# EAGLE design extruderControllerv02 (EAGLE 9.2.2)
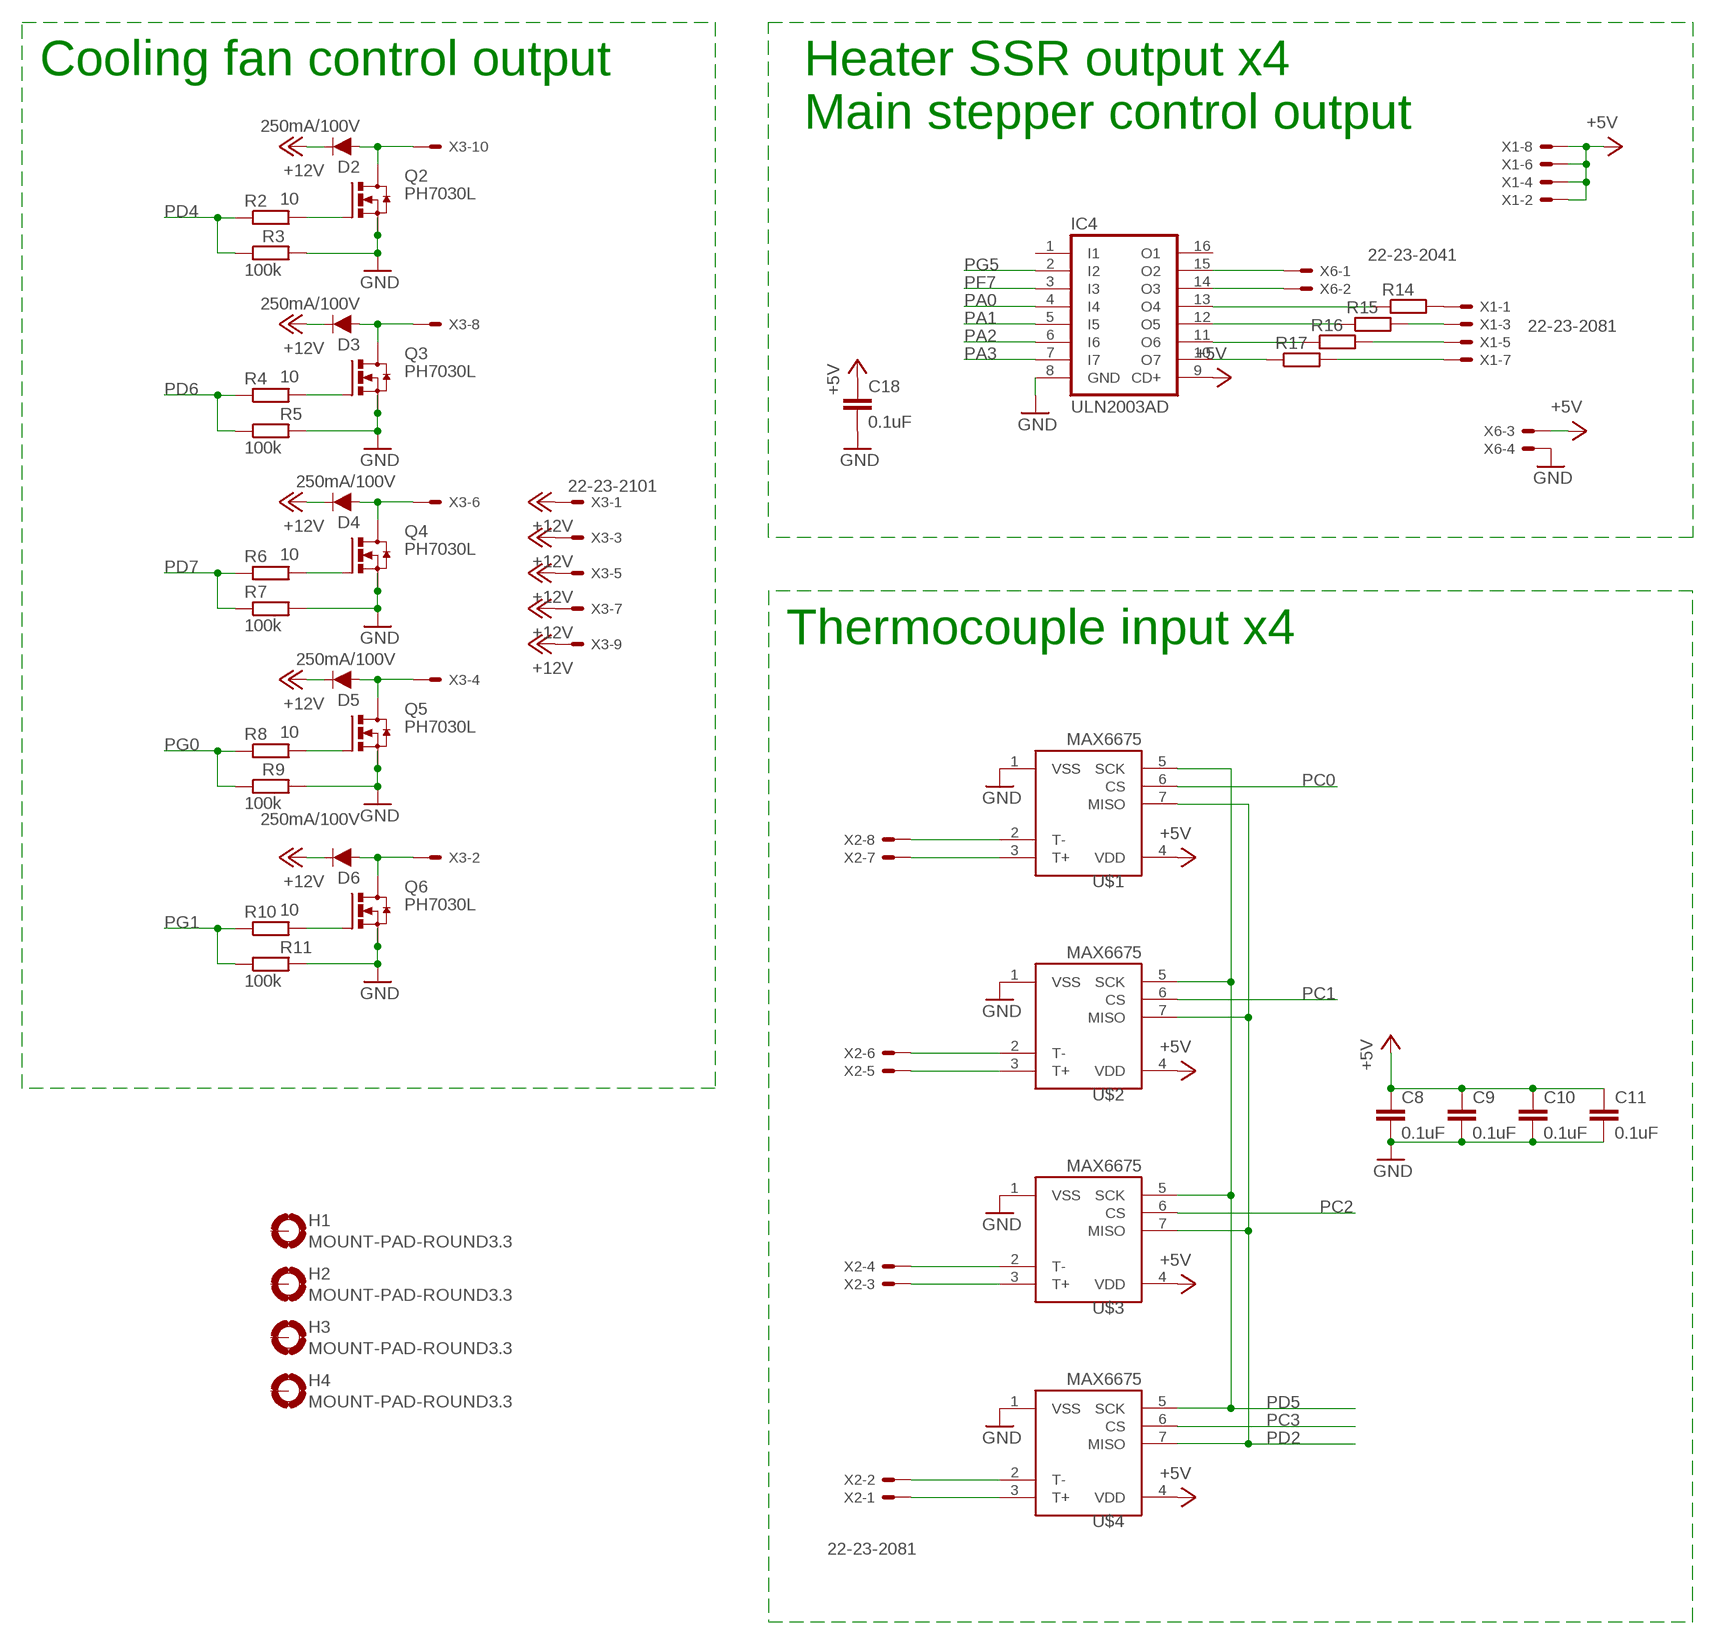
[diagram p0: schematic, sheet 1, part 1 of 2]
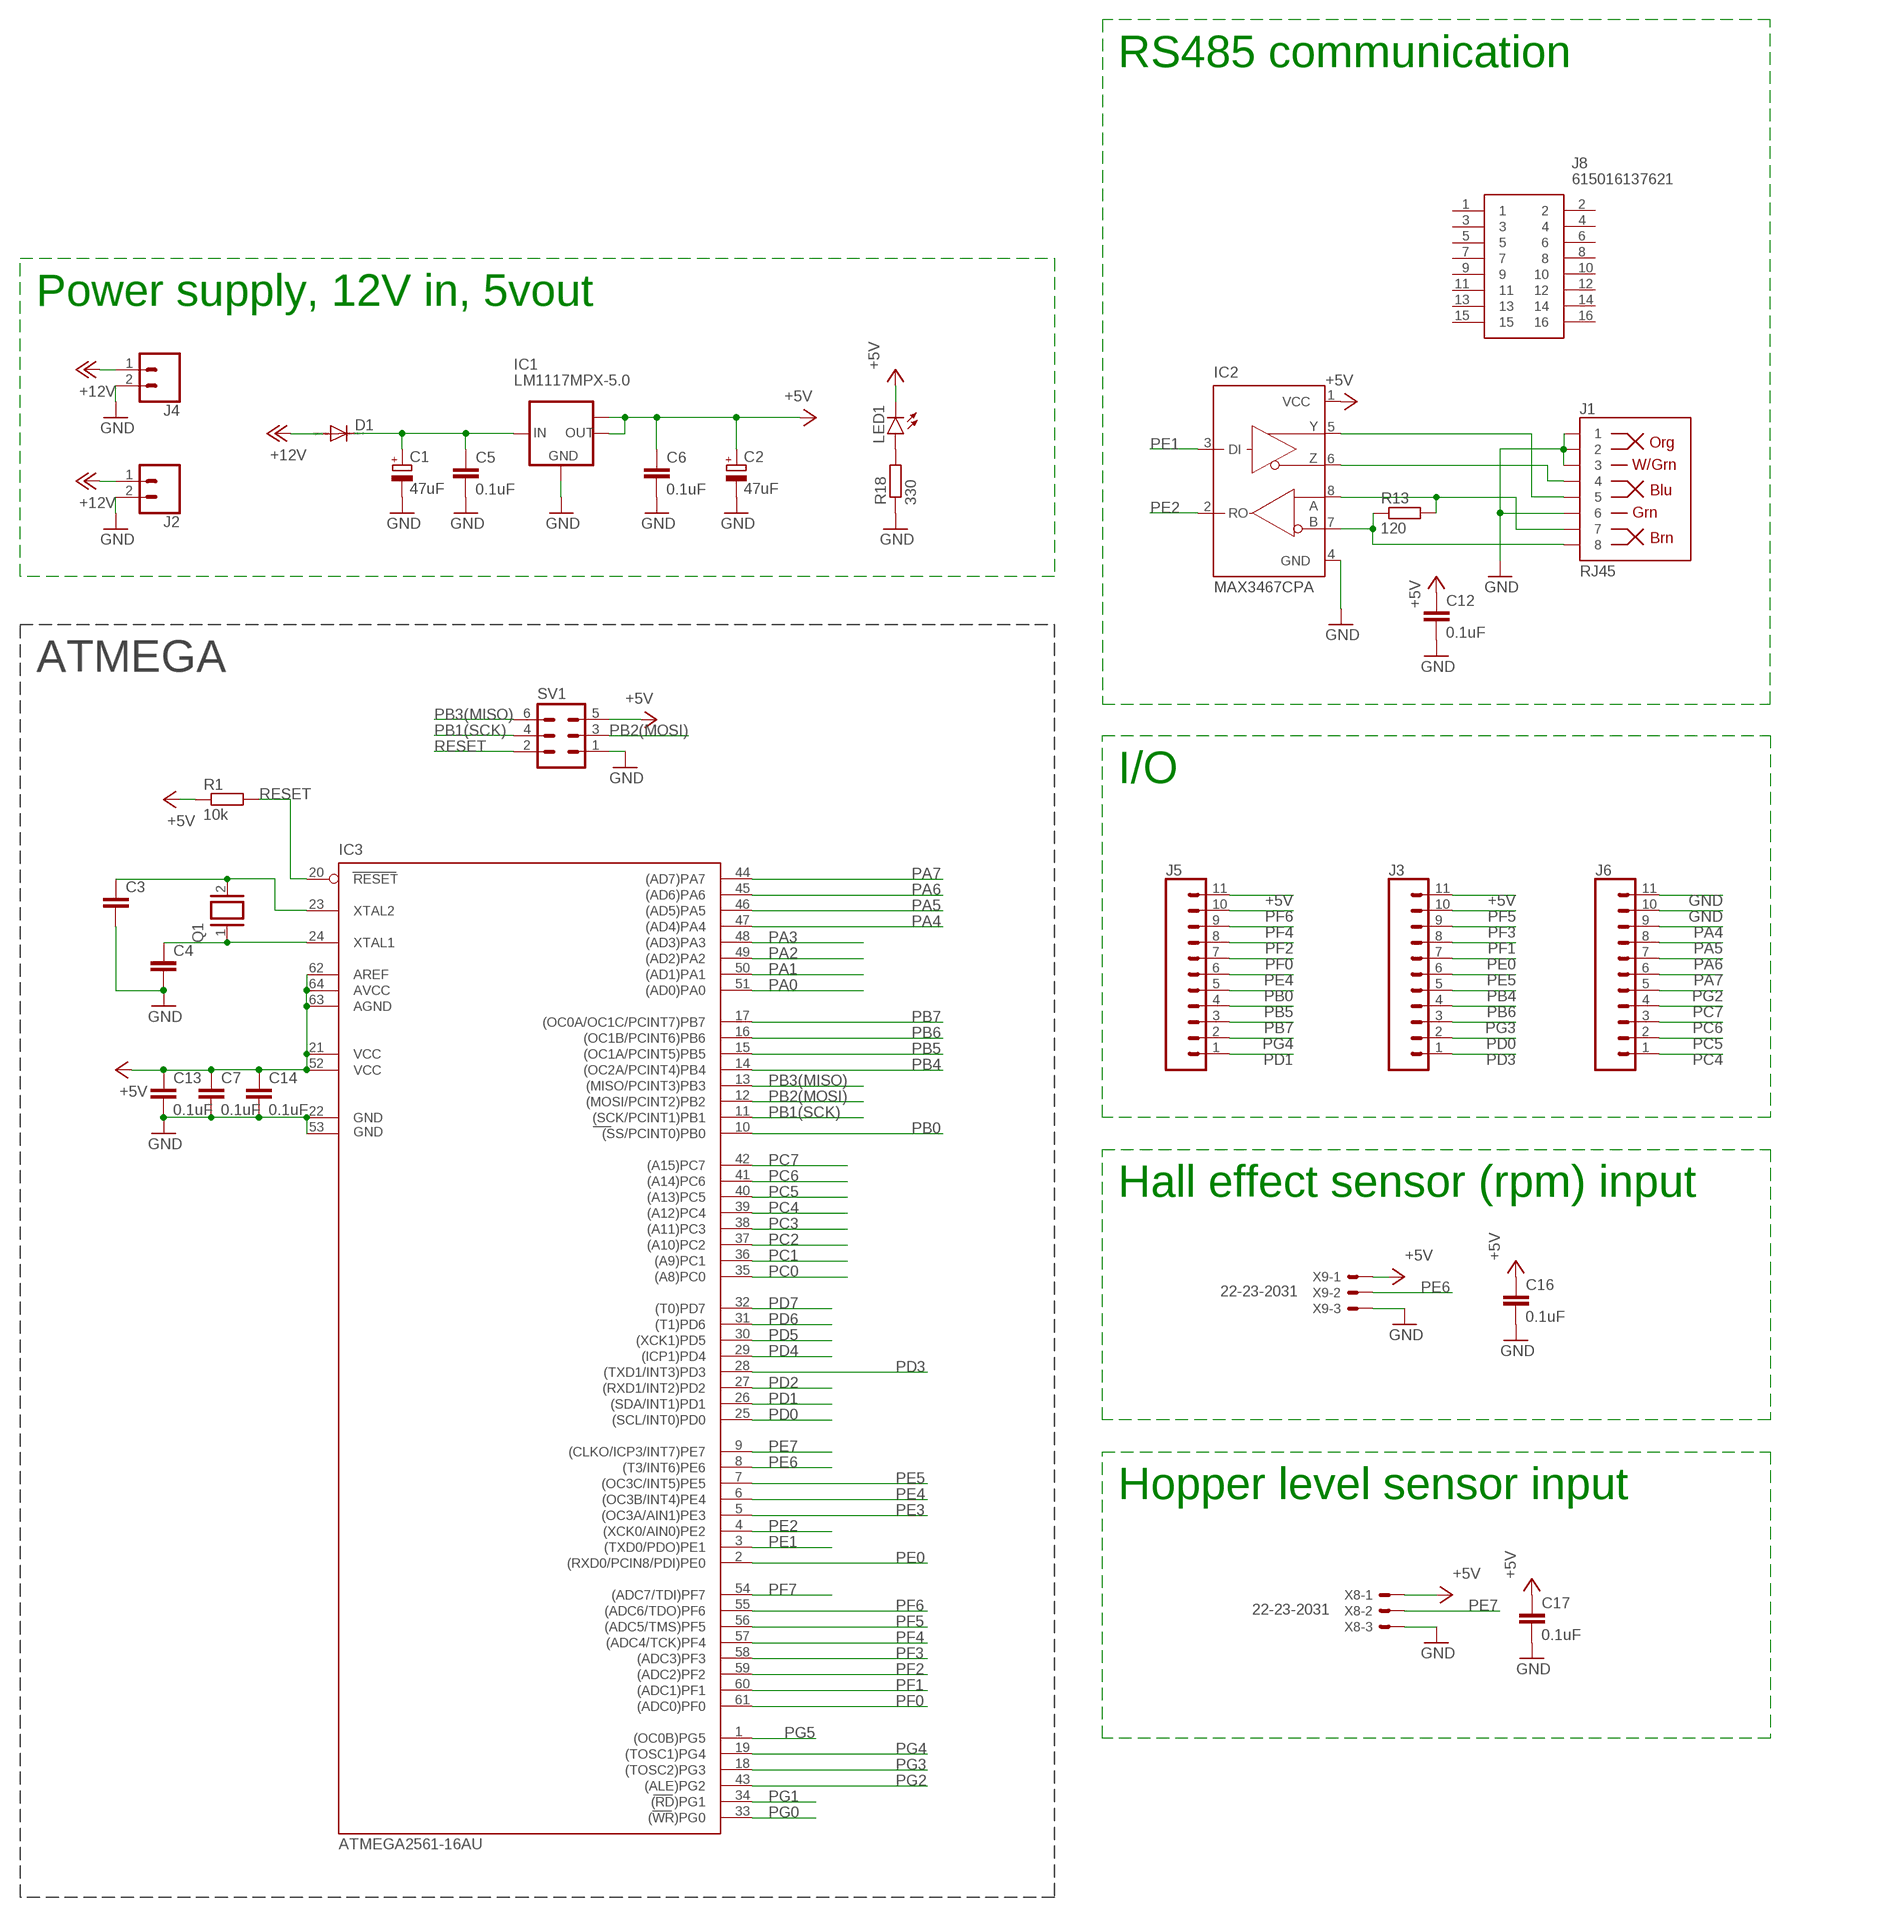
[diagram p1: schematic, sheet 1, part 2 of 2]

## Parts
C1  47uF  CPOL-EUD  [PANASONIC_D]
C2  47uF  CPOL-EUD  [PANASONIC_D]
C3  C-EUC0603  [C0603]
C4  C-EUC0603  [C0603]
C5  0.1uF  C-EUC0603  [C0603]
C6  0.1uF  C-EUC0603  [C0603]
C7  0.1uF  C-EUC0603  [C0603]
C8  0.1uF  C-EUC0603  [C0603]
C9  0.1uF  C-EUC0603  [C0603]
C10  0.1uF  C-EUC0603  [C0603]
C11  0.1uF  C-EUC0603  [C0603]
C12  0.1uF  C-EUC0603  [C0603]
C13  0.1uF  C-EUC0603  [C0603]
C14  0.1uF  C-EUC0603  [C0603]
C16  0.1uF  C-EUC0603  [C0603]
C17  0.1uF  C-EUC0603  [C0603]
C18  0.1uF  C-EUC0603  [C0603]
D1  DIODE-SMB  [SMB]
D2  250mA/100V  DIODE-BAS16J  [SOD-323]
D3  250mA/100V  DIODE-BAS16J  [SOD-323]
D4  250mA/100V  DIODE-BAS16J  [SOD-323]
D5  250mA/100V  DIODE-BAS16J  [SOD-323]
D6  250mA/100V  DIODE-BAS16J  [SOD-323]
H1  MOUNT-PAD-ROUND3.3  [3,3-PAD]
H2  MOUNT-PAD-ROUND3.3  [3,3-PAD]
H3  MOUNT-PAD-ROUND3.3  [3,3-PAD]
H4  MOUNT-PAD-ROUND3.3  [3,3-PAD]
IC1  LM1117MPX-5.0  [SOT223]
IC2  MAX3467CPA  [SO08]
IC3  ATMEGA2561-16AU  [TQFP64]
IC4  ULN2003AD  [SO16]
J1  RJ45  RJ45-8  [RJ45-8]
J2  CONN_023.5MM  [SCREWTERMINAL-3.5MM-2]
J3  CONN_11  [1X11]
J4  CONN_023.5MM  [SCREWTERMINAL-3.5MM-2]
J5  CONN_11  [1X11]
J6  CONN_11  [1X11]
J8  615016137621  [WR-MJ]
LED1  LEDSML1206  [SML1206]
Q1  XTAL/S  [QS]
Q2  PH7030L  [SOT669]
Q3  PH7030L  [SOT669]
Q4  PH7030L  [SOT669]
Q5  PH7030L  [SOT669]
Q6  PH7030L  [SOT669]
R1  10k  R-EU_R0805  [R0805]
R2  10  R-EU_R0805  [R0805]
R3  100k  R-EU_R0805  [R0805]
R4  10  R-EU_R0805  [R0805]
R5  100k  R-EU_R0805  [R0805]
R6  10  R-EU_R0805  [R0805]
R7  100k  R-EU_R0805  [R0805]
R8  10  R-EU_R0805  [R0805]
R9  100k  R-EU_R0805  [R0805]
R10  10  R-EU_R0805  [R0805]
R11  100k  R-EU_R0805  [R0805]
R13  120  R-EU_R1210  [R1210]
R14  R-EU_R0805  [R0805]
R15  R-EU_R0805  [R0805]
R16  R-EU_R0805  [R0805]
R17  R-EU_R0805  [R0805]
R18  330  R-EU_R0805  [R0805]
SV1  MA03-2  [MA03-2]
U$1  MAX6675  [SO08-MAX6675]
U$2  MAX6675  [SO08-MAX6675]
U$3  MAX6675  [SO08-MAX6675]
U$4  MAX6675  [SO08-MAX6675]
X1  22-23-2081  [22-23-2081]
X2  22-23-2081  [22-23-2081]
X3  22-23-2101  [22-23-2101]
X6  22-23-2041  [22-23-2041]
X8  22-23-2031  [22-23-2031]
X9  22-23-2031  [22-23-2031]

## Nets
+5V: C2.+ C6.1 C7.1 C8.1 C9.1 C10.1 C11.1 C12.1 C13.1 C14.1 C16.1 C17.1 C18.1 IC1.2(OUT) IC1.TAB(OUT1) IC2.1(VCC) IC3.21(VCC) IC3.52(VCC1) IC3.62(AREF) IC3.63(AGND) IC3.64(AVCC) IC4.9(CD+) J3.11 J5.11 LED1.C R1.1 SV1.5 U$1.4(VDD) U$2.4(VDD) U$3.4(VDD) U$4.4(VDD) X1.2 X1.4 X1.6 X1.8 X6.3 X8.1 X9.1
+12V: D1.A D2.C D3.C D4.C D5.C D6.C J2.1 J4.1 X3.1 X3.3 X3.5 X3.7 X3.9
GND: C1.- C2.- C3.2 C4.2 C5.2 C6.2 C7.2 C8.2 C9.2 C10.2 C11.2 C12.2 C13.2 C14.2 C16.2 C17.2 C18.2 IC1.1(GND) IC2.4(GND) IC3.22(GND) IC3.53(GND1) IC4.8(GND) J1.1 J1.2 J1.3 J1.6 J2.2 J4.2 J6.10 J6.11 Q2.1(S) Q2.2(S) Q2.3(S) Q3.1(S) Q3.2(S) Q3.3(S) Q4.1(S) Q4.2(S) Q4.3(S) Q5.1(S) Q5.2(S) Q5.3(S) Q6.1(S) Q6.2(S) Q6.3(S) R3.2 R5.2 R7.2 R9.2 R11.2 R18.1 SV1.1 U$1.1(VSS) U$2.1(VSS) U$3.1(VSS) U$4.1(VSS) X6.4 X8.3 X9.3
N$2: Q2.4(G) R2.2
N$3: R14.2 X1.1
N$4: U$1.2(T-) X2.8
N$5: U$1.3(T+) X2.7
N$6: U$2.2(T-) X2.6
N$7: U$2.3(T+) X2.5
N$8: U$3.2(T-) X2.4
N$9: U$3.3(T+) X2.3
N$10: U$4.2(T-) X2.2
N$11: U$4.3(T+) X2.1
N$12: R15.2 X1.3
N$13: R16.2 X1.5
N$14: R17.2 X1.7
N$15: IC4.15(O2) X6.1
N$18: C1.+ C5.1 D1.C IC1.3(IN)
N$19: C3.1 IC3.23(XTAL2) Q1.2
N$20: C4.1 IC3.24(XTAL1) Q1.1
N$21: IC4.14(O3) X6.2
N$22: D2.A Q2.MB(D) X3.10
N$23: Q3.4(G) R4.2
N$25: D3.A Q3.MB(D) X3.8
N$26: Q4.4(G) R6.2
N$27: IC2.7(B) J1.8 R13.1
N$28: D4.A Q4.MB(D) X3.6
N$29: Q5.4(G) R8.2
N$30: IC4.13(O4) R14.1
N$31: D5.A Q5.MB(D) X3.4
N$32: Q6.4(G) R10.2
N$33: IC2.5(Y) J1.5
N$34: D6.A Q6.MB(D) X3.2
N$36: IC2.8(A) J1.7 R13.2
N$38: IC4.12(O5) R15.1
N$39: IC4.11(O6) R16.1
N$40: IC4.10(O7) R17.1
N$41: LED1.A R18.2
N$45: IC2.6(Z) J1.4
PA0: IC3.51((AD0)PA0) IC4.4(I4)
PA1: IC3.50((AD1)PA1) IC4.5(I5)
PA2: IC3.49((AD2)PA2) IC4.6(I6)
PA3: IC3.48((AD3)PA3) IC4.7(I7)
PA4: IC3.47((AD4)PA4) J6.9
PA5: IC3.46((AD5)PA5) J6.8
PA6: IC3.45((AD6)PA6) J6.7
PA7: IC3.44((AD7)PA7) J6.6
PB0: IC3.10((SS/PCINT0)PB0) J5.5
PB1(SCK): IC3.11((SCK/PCINT1)PB1) SV1.4
PB2(MOSI): IC3.12((MOSI/PCINT2)PB2) SV1.3
PB3(MISO): IC3.13((MISO/PCINT3)PB3) SV1.6
PB4: IC3.14((OC2A/PCINT4)PB4) J3.5
PB5: IC3.15((OC1A/PCINT5)PB5) J5.4
PB6: IC3.16((OC1B/PCINT6)PB6) J3.4
PB7: IC3.17((OC0A/OC1C/PCINT7)PB7) J5.3
PC0: IC3.35((A8)PC0) U$1.6(CS)
PC1: IC3.36((A9)PC1) U$2.6(CS)
PC2: IC3.37((A10)PC2) U$3.6(CS)
PC3: IC3.38((A11)PC3) U$4.6(CS)
PC4: IC3.39((A12)PC4) J6.1
PC5: IC3.40((A13)PC5) J6.2
PC6: IC3.41((A14)PC6) J6.3
PC7: IC3.42((A15)PC7) J6.4
PD0: IC3.25((SCL/INT0)PD0) J3.2
PD1: IC3.26((SDA/INT1)PD1) J5.1
PD2: IC3.27((RXD1/INT2)PD2) U$1.7(MISO) U$2.7(MISO) U$3.7(MISO) U$4.7(MISO)
PD3: IC3.28((TXD1/INT3)PD3) J3.1
PD4: IC3.29((ICP1)PD4) R2.1 R3.1
PD5: IC3.30((XCK1)PD5) U$1.5(SCK) U$2.5(SCK) U$3.5(SCK) U$4.5(SCK)
PD6: IC3.31((T1)PD6) R4.1 R5.1
PD7: IC3.32((T0)PD7) R6.1 R7.1
PE0: IC3.2((RXD0/PCIN8/PDI)PE0) J3.7
PE1: IC2.3(DI) IC3.3((TXD0/PDO)PE1)
PE2: IC2.2(RO) IC3.4((XCK0/AIN0)PE2)
PE3: IC3.5((OC3A/AIN1)PE3)
PE4: IC3.6((OC3B/INT4)PE4) J5.6
PE5: IC3.7((OC3C/INT5)PE5) J3.6
PE6: IC3.8((T3/INT6)PE6) X9.2
PE7: IC3.9((CLKO/ICP3/INT7)PE7) X8.2
PF0: IC3.61((ADC0)PF0) J5.7
PF1: IC3.60((ADC1)PF1) J3.8
PF2: IC3.59((ADC2)PF2) J5.8
PF3: IC3.58((ADC3)PF3) J3.9
PF4: IC3.57((ADC4/TCK)PF4) J5.9
PF5: IC3.56((ADC5/TMS)PF5) J3.10
PF6: IC3.55((ADC6/TDO)PF6) J5.10
PF7: IC3.54((ADC7/TDI)PF7) IC4.3(I3)
PG0: IC3.33((WR)PG0) R8.1 R9.1
PG1: IC3.34((RD)PG1) R10.1 R11.1
PG2: IC3.43((ALE)PG2) J6.5
PG3: IC3.18((TOSC2)PG3) J3.3
PG4: IC3.19((TOSC1)PG4) J5.2
PG5: IC3.1((OC0B)PG5) IC4.2(I2)
RESET: IC3.20(RESET) R1.2 SV1.2
Unconnected: H1.B3,3(MOUNT) H2.B3,3(MOUNT) H3.B3,3(MOUNT) H4.B3,3(MOUNT) IC4.1(I1) IC4.16(O1) J8.1 J8.2 J8.3 J8.4 J8.5 J8.6 J8.7 J8.8 J8.9 J8.10 J8.11 J8.12 J8.13 J8.14 J8.15 J8.16

## Notes on the sheet
- RS485 communication
- Cooling fan control output | Heater SSR output x4 | Power supply, 12V in, 5vout
- Main stepper control output
- ATMEGA
- I/O
- Thermocouple input x4
- Hall effect sensor (rpm) input
- Hopper level sensor input

## Library data of the parts
C1 C2 = rcl:CPOL-EU: POLARIZED CAPACITOR, European symbol; SPICEPREFIX: C
C3-C14 C16-C18 = rcl:C-EU: CAPACITOR, European symbol; SPICEPREFIX: C
D1 = diode:DIODE-: DIODE
D2-D6 = SparkFun-DiscreteSemi:DIODE: Diode These are standard reverse protection diodes and small signal diodes. SparkFun Products: SparkFun SparkPunk Sound Kit <https://www.sparkfun.com/products/11177> SparkFun ESP8266 Thing <https://www.sparkfun.com/products/13231>; PROD_ID: DIO-09646
H1-H4 = holes:MOUNT-PAD-ROUND: MOUNTING PAD, round
IC1 = lm1117:LM1117MPX-*
IC2 = maxim:MAX3467*: +5V, Fail-Safe, 40Mbps, Profibus RS-485/RS-422 Transceivers Source: MAX3465-MAX3469.pdf; OC_FARNELL: unknown; OC_NEWARK: unknown
IC3 = atmel-2005:ATMEGA2561*: MICROCONTROLLER 256 Kbytes FLASH 4 Kbytes EEPROM 8 Kbytes SRAM 54 General Purpose I/O pins 6-channels 16-bit PWM 2 x Serial USARTs 8-channels 10-bit A/D
IC4 = uln-udn:ULN2003A: DRIVER ARRAY
J1 = SparkFun-Connectors:RJ45-8: RJ45 Jack - 8 pin Simple RJ45, 8-pin connection. Commonly used for Cat5, Cat5e, and Cat6 Ethernet cables. Here is the connector we sell at SparkFun: RJ45 8-Pin Connector <https://www.sparkfun.com/products/643> (PRT-00643) Datasheet <https://cdn.sparkfun.com/datasheets/Prototyping/04908.pdf> It is used on this SparkFun product: SparkFun RJ45 Breakout <https://www.sparkfun.com/products/716> (BOB-00716) Note, you may also be interested in the "MAGJACK" version of this. It is basically a RJ45 connector, but also has some status LEDs built into the connector housing. You can check that out in this library at the device named "MAGJACK.dev" and see these products online: RJ45 Ethernet MagJack-Compatible <https://www.sparkfun.com/products/8534> (PRT-08534) SparkFun RJ45 MagJack Breakout <https://www.sparkfun.com/products/13021> (BOB-13021); PROD_ID: CONN-08506; SF_ID: PRT-00643
J2 J4 = SparkFun-Connectors:CONN_02: Multi connection point. Often used as Generic Header-pin footprint for 0.1 inch spaced/style header connections On any of the 0.1 inch spaced packages, you can populate with these: Break Away Headers - Straight <https://www.sparkfun.com/products/116> (PRT-00116) Break Away Male Headers - Right Angle <https://www.sparkfun.com/products/553> (PRT-00553) Female Headers <https://www.sparkfun.com/products/115> (PRT-00115) Break Away Headers - Machine Pin <https://www.sparkfun.com/products/117> (PRT-00117) Break Away Female Headers - Swiss Machine Pin <https://www.sparkfun.com/products/743> (PRT-00743) For SCREWTERMINALS and SPRING TERMINALS visit here: Screw Terimnals on SparkFun.com <https://www.sparkfun.com/search/results?term=Screw+Terminals> (5mm/3.5mm/2.54mm spacing) This device is also useful as a general connection point to wire up your design to another part of your project. Our various solder wires solder well into these plated through hole pads. Hook-Up Wire - Assortment (Stranded, 22 AWG) <https://www.sparkfun.com/products/11375> (PRT-11375) Hook-Up Wire - Assortment (Solid Core, 22 AWG) <https://www.sparkfun.com/products/11367> (PRT-11367) View the entire wire category on our website here <https://www.sparkfun.com/categories/141> Special notes: Molex polarized connector foot print use with: PRT-08233 with associated crimp pins and housings. 2.54_SCREWTERM for use with PRT-10571. 3.5mm Screw Terminal footprints for PRT-08084 5mm Screw Terminal footprints for use with PRT-08432; PROD_ID: CONN-08399
J3 J5 J6 = SparkFun-Connectors:CONN_11: Multi connection point. Often used as Generic Header-pin footprint for 0.1 inch spaced/style header connections On any of the 0.1 inch spaced packages, you can populate with these: Break Away Headers - Straight <https://www.sparkfun.com/products/116> (PRT-00116) Break Away Male Headers - Right Angle <https://www.sparkfun.com/products/553> (PRT-00553) Female Headers <https://www.sparkfun.com/products/115> (PRT-00115) Break Away Headers - Machine Pin <https://www.sparkfun.com/products/117> (PRT-00117) Break Away Female Headers - Swiss Machine Pin <https://www.sparkfun.com/products/743> (PRT-00743) For SCREWTERMINALS and SPRING TERMINALS visit here: Screw Terimnals on SparkFun.com <https://www.sparkfun.com/search/results?term=Screw+Terminals> (5mm/3.5mm/2.54mm spacing) This device is also useful as a general connection point to wire up your design to another part of your project. Our various solder wires solder well into these plated through hole pads. Hook-Up Wire - Assortment (Stranded, 22 AWG) <https://www.sparkfun.com/products/11375> (PRT-11375) Hook-Up Wire - Assortment (Solid Core, 22 AWG) <https://www.sparkfun.com/products/11367> (PRT-11367) View the entire wire category on our website here <https://www.sparkfun.com/categories/141>
J8 = SamacSys_Parts:615016137621: Wurth Elektronik Female Cat5e RJ45 Connector, Shielded, Right Angle, PCB Mount Mount, Source: Datasheet <http://www.mouser.com/datasheet/2/445/615016137621-537831.pdf>; DESCRIPTION: Wurth Elektronik Female Cat5e RJ45 Connector, Shielded, Right Angle, PCB Mount Mount,; HEIGHT: mm; MANUFACTURER_NAME: Wurth Elektronik; MANUFACTURER_PART_NUMBER: 615016137621; MOUSER_PART_NUMBER: 710-615016137621; MOUSER_PRICE-STOCK: https://www.mouser.com/Search/Refine.aspx?Keyword=710-615016137621
LED1 = led:LED: LED OSRAM: - CHIPLED LG R971, LG N971, LY N971, LG Q971, LY Q971, LO R971, LY R971 LH N974, LH R974 LS Q976, LO Q976, LY Q976 LO Q996 - Hyper CHIPLED LW Q18S LB Q993, LB Q99A, LB R99A - SideLED LS A670, LO A670, LY A670, LG A670, LP A670 LB A673, LV A673, LT A673, LW A673 LH A674 LY A675 LS A676, LA A676, LO A676, LY A676, LW A676 LS A679, LY A679, LG A679 - Hyper Micro SIDELED® LS Y876, LA Y876, LO Y876, LY Y876 LT Y87S - SmartLED LW L88C, LW L88S LB L89C, LB L89S, LG L890 LS L89K, LO L89K, LY L89K LS L896, LA L896, LO L896, LY L896 - TOPLED LS T670, LO T670, LY T670, LG T670, LP T670 LSG T670, LSP T670, LSY T670, LOP T670, LYG T670 LG T671, LOG T671, LSG T671 LB T673, LV T673, LT T673, LW T673 LH T674 LS T676, LA T676, LO T676, LY T676, LB T676, LH T676, LSB T676, LW T676 LB T67C, LV T67C, LT T67C, LS T67K, LO T67K, LY T67K, LW E67C LS E67B, LA E67B, LO E67B, LY E67B, LB E67C, LV E67C, LT E67C LW T67C LS T679, LY T679, LG T679 LS T770, LO T770, LY T770, LG T770, LP T770 LB T773, LV T773, LT T773, LW T773 LH T774 LS E675, LA E675, LY E675, LS T675 LS T776, LA T776, LO T776, LY T776, LB T776 LHGB T686 LT T68C, LB T68C - Hyper Mini TOPLED® LB M676 - Mini TOPLED Santana® LG M470 LS M47K, LO M47K, LY M47K Source: http://www.osram.convergy.de LUXEON: - LUMILED® LXK2-PW12-R00, LXK2-PW12-S00, LXK2-PW14-U00, LXK2-PW14-V00 LXK2-PM12-R00, LXK2-PM12-S00, LXK2-PM14-U00 LXK2-PE12-Q00, LXK2-PE12-R00, LXK2-PE12-S00, LXK2-PE14-T00, LXK2-PE14-U00 LXK2-PB12-K00, LXK2-PB12-L00, LXK2-PB12-M00, LXK2-PB14-N00, LXK2-PB14-P00, LXK2-PB14-Q00 LXK2-PR12-L00, LXK2-PR12-M00, LXK2-PR14-Q00, LXK2-PR14-R00 LXK2-PD12-Q00, LXK2-PD12-R00, LXK2-PD12-S00 LXK2-PH12-R00, LXK2-PH12-S00 LXK2-PL12-P00, LXK2-PL12-Q00, LXK2-PL12-R00 Source: www.luxeon.com KINGBRIGHT: KA-3528ASYC Source: www.kingbright.com
Q1 = special:XTAL/S: CRYSTAL; SPICEPREFIX: B
Q2-Q6 = transistor-power:PH7030L: N-channel TrenchMOS (TM) logic level FET Source: http://www.nxp.com/acrobat_download/datasheets/PH7030L_4.pdf
R1-R11 R13-R18 = rcl:R-EU_: RESISTOR, European symbol; SPICEPREFIX: R
SV1 = con-lstb:MA03-2: PIN HEADER; OC_FARNELL: unknown; OC_NEWARK: unknown
U$1-U$4 = SparkFun-AnalogIC:MAX6675: K-type thermocouple ADC, SPI output
X1 X2 = con-molex:22-23-2081: .100" (2.54mm) Center Header - 8 Pin; MF: MOLEX; MPN: 22-23-2081; OC_FARNELL: 1756826; OC_NEWARK: 01C7592
X3 = con-molex:22-23-2101: .100" (2.54mm) Center Header - 10 Pin; MF: MOLEX; MPN: 22-23-2101; OC_FARNELL: 1756828; OC_NEWARK: 94C0765
X6 = con-molex:22-23-2041: .100" (2.54mm) Center Header - 4 Pin; MF: MOLEX; MPN: 22-23-2041; OC_FARNELL: 1462920; OC_NEWARK: 38C0355
X8 X9 = con-molex:22-23-2031: .100" (2.54mm) Center Header - 3 Pin; MF: MOLEX; MPN: 22-23-2031; OC_FARNELL: 1462950; OC_NEWARK: 30C0862

## Board
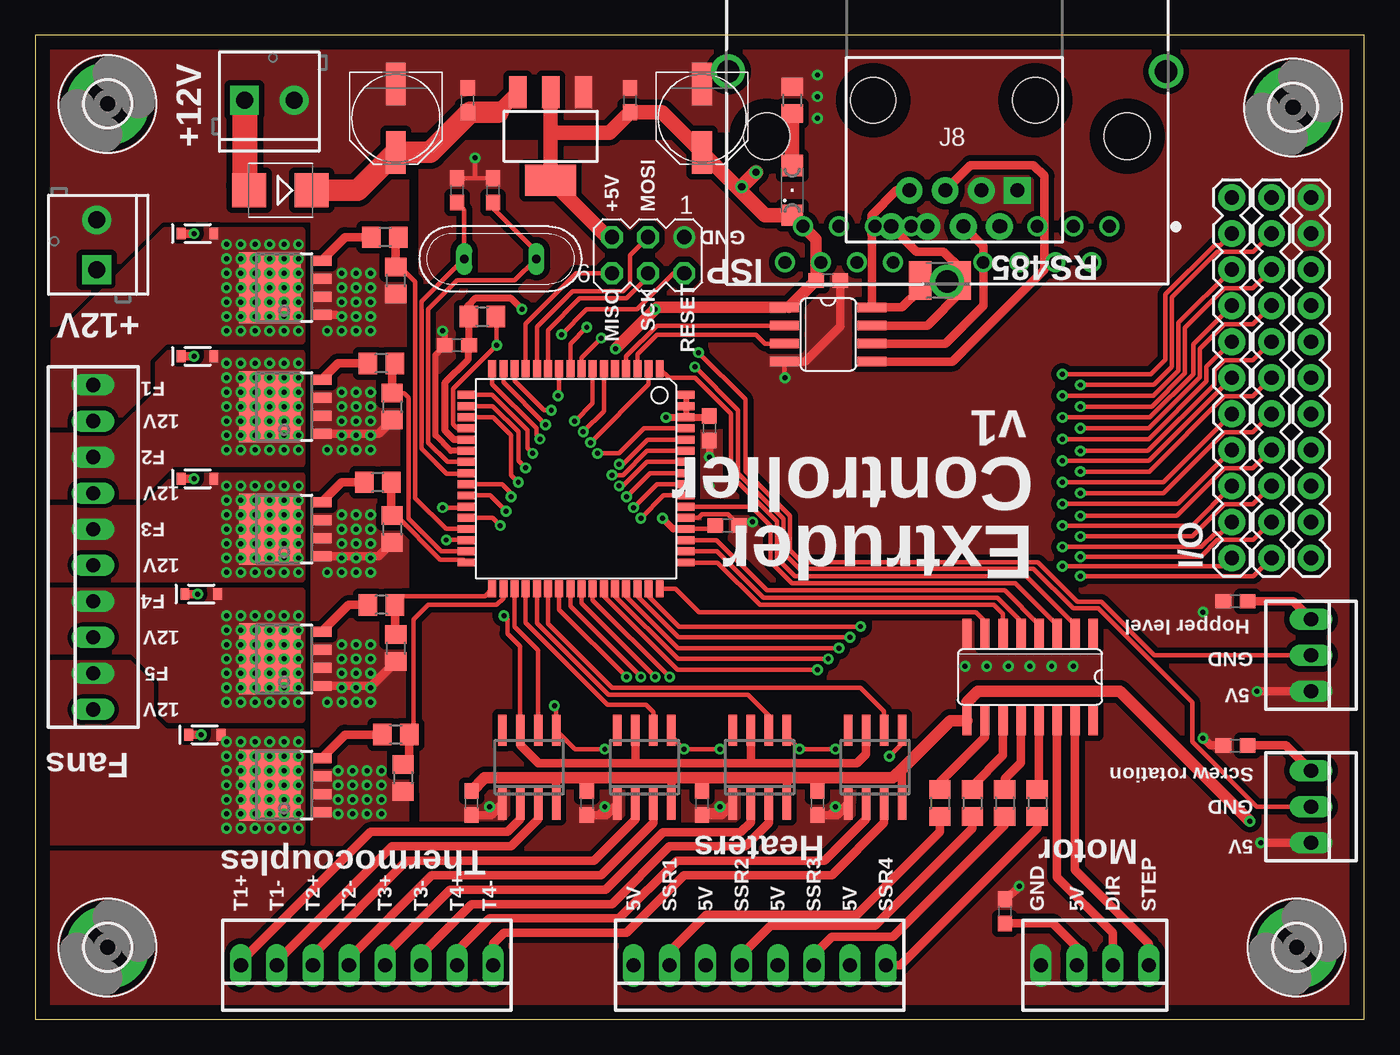
[diagram p2: board, top side]
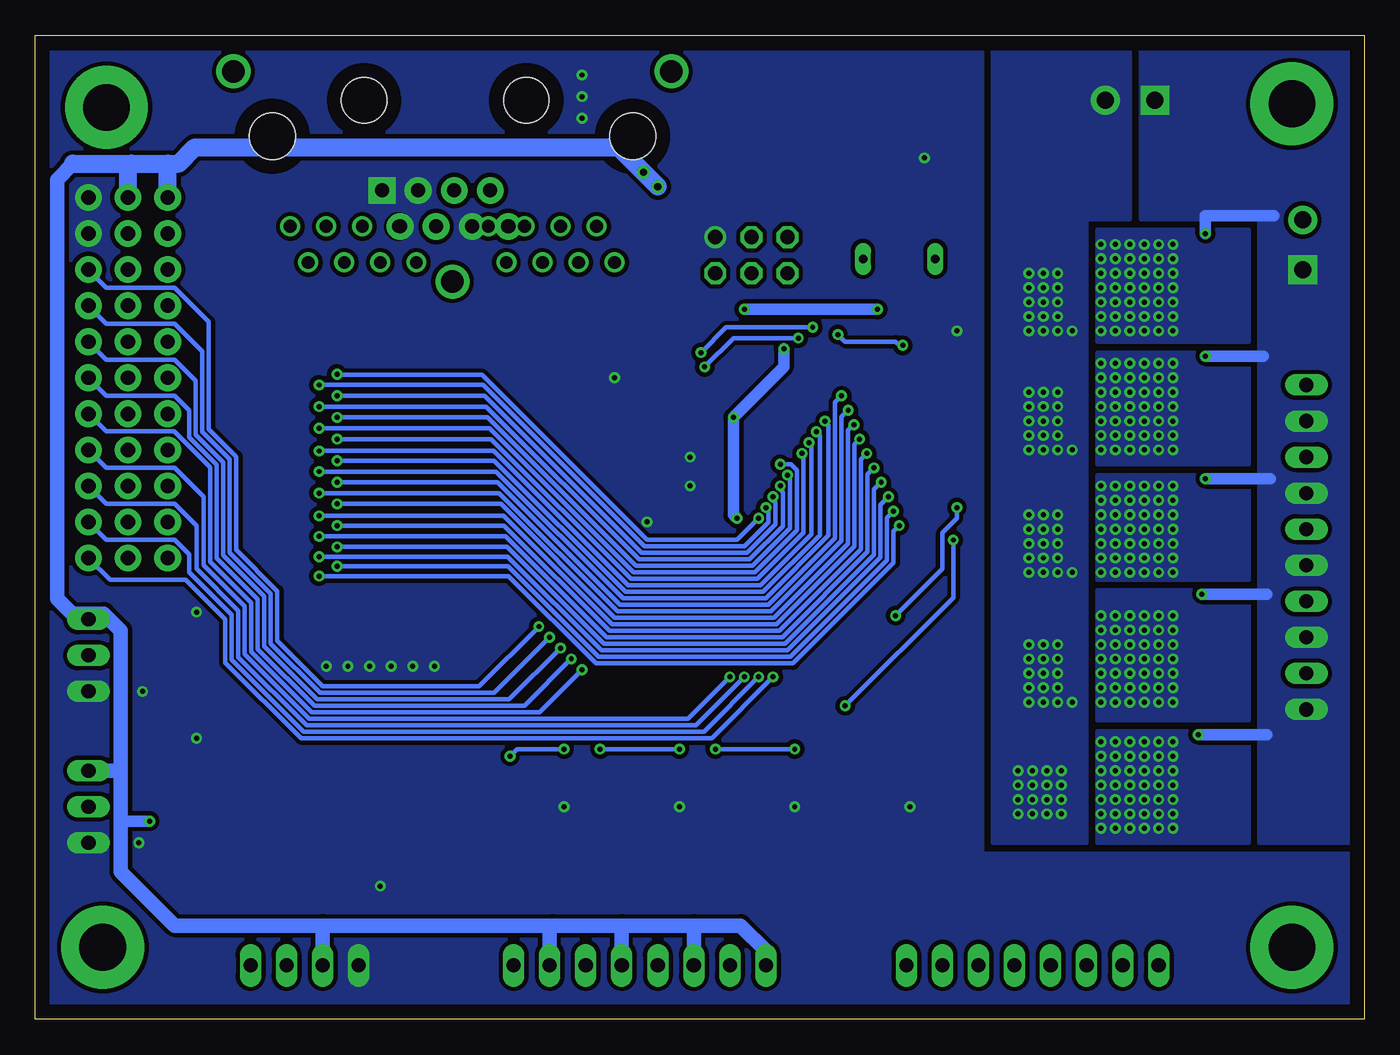
[diagram p3: board, bottom side, seen from below]

Size 93.65 x 69.33 mm. Coordinates in mm from the lower left corner, seen from the top.
Outline: 0,0 93.65,0 93.65,69.33 0,69.33 0,0
Copper layers (1*16): Top 0.035mm / dielectric 1.5mm / Bottom 0.035mm
Design rules "default *": minimum track width 6mil, minimum drill 0.35mm, track to track 6mil, track to pad 6mil, pad to pad 6mil, via to via 6mil, smd to smd 6mil, copper to edge 40mil, drill to drill 6mil, minimum pad ring 10mil, minimum via ring 8mil, stop-mask expansion 4mil, vias tented up to drill 25mil, thermal gap 10mil

### Footprints (pad centres in the part's own frame; a part is rotated, then mirrored left to right if it is on the bottom)
PANASONIC_D = smd 3 x 1.4: + 2.4,0; - -2.4,0
C0603 = smd 1.1 x 1: 1 -0.85,0; 2 0.85,0
SMB = smd 2.4 x 2.4: A 2.2,0; C -2.2,0
SOD-323 = smd 0.63 x 0.83: A 1.15,0; C -1.15,0
3,3-PAD = drill 3.3 pad 5.842: B3,3 0,0
SOT223 = smd 1.219 x 2.235: 1 -2.311,-3.099; 2 0,-3.099; 3 2.311,-3.099 | smd 3.6 x 2.2: TAB 0,3.099
SO08 = smd 0.66 x 2.032: 1 -1.905,-3.073; 2 -0.635,-3.073; 3 0.635,-3.073; 4 1.905,-3.073; 5 1.905,3.073; 6 0.635,3.073; 7 -0.635,3.073; 8 -1.905,3.073
TQFP64 = smd 1.194 x 0.559: 1 -7.76,5.905; 2 -7.76,5.118; 3 -7.76,4.331; 4 -7.76,3.543; 5 -7.76,2.756; 6 -7.76,1.968; 7 -7.76,1.181; 8 -7.76,0.394; 9 -7.76,-0.394; 10 -7.76,-1.181; 11 -7.76,-1.968; 12 -7.76,-2.756; 13 -7.76,-3.543; 14 -7.76,-4.331; 15 -7.76,-5.118; 16 -7.76,-5.905; 33 7.76,-5.905; 34 7.76,-5.118; 35 7.76,-4.331; 36 7.76,-3.543; 37 7.76,-2.756; 38 7.76,-1.968; 39 7.76,-1.181; 40 7.76,-0.394; 41 7.76,0.394; 42 7.76,1.181; 43 7.76,1.968; 44 7.76,2.756; 45 7.76,3.543; 46 7.76,4.331; 47 7.76,5.118; 48 7.76,5.905 | smd 0.559 x 1.194: 17 -5.905,-7.76; 18 -5.118,-7.76; 19 -4.331,-7.76; 20 -3.543,-7.76; 21 -2.756,-7.76; 22 -1.968,-7.76; 23 -1.181,-7.76; 24 -0.394,-7.76; 25 0.394,-7.76; 26 1.181,-7.76; 27 1.968,-7.76; 28 2.756,-7.76; 29 3.543,-7.76; 30 4.331,-7.76; 31 5.118,-7.76; 32 5.905,-7.76; 49 5.905,7.76; 50 5.118,7.76; 51 4.331,7.76; 52 3.543,7.76; 53 2.756,7.76; 54 1.968,7.76; 55 1.181,7.76; 56 0.394,7.76; 57 -0.394,7.76; 58 -1.181,7.76; 59 -1.968,7.76; 60 -2.756,7.76; 61 -3.543,7.76; 62 -4.331,7.76; 63 -5.118,7.76; 64 -5.905,7.76
SO16 = smd 0.66 x 2.032: 1 -4.445,-3.073; 2 -3.175,-3.073; 3 -1.905,-3.073; 4 -0.635,-3.073; 5 0.635,-3.073; 6 1.905,-3.073; 7 3.175,-3.073; 8 4.445,-3.073; 9 4.445,3.073; 10 3.175,3.073; 11 1.905,3.073; 12 0.635,3.073; 13 -0.635,3.073; 14 -1.905,3.073; 15 -3.175,3.073; 16 -4.445,3.073
RJ45-8 = drill 1 pad 1.88 square: 1 -4.445,6.35 | drill 1 pad 1.88: 2 -3.175,8.89; 3 -1.905,6.35; 4 -0.635,8.89; 5 0.635,6.35; 6 1.905,8.89; 7 3.175,6.35; 8 4.445,8.89 | hole 3.2: -5.715,0; 5.715,0
SCREWTERMINAL-3.5MM-2 = drill 1.2 pad 2.032 square: 1 0,0 | drill 1.2 pad 2.032: 2 3.5,0
1X11 = drill 1.016 pad 1.88: 1 0,0; 2 2.54,0; 3 5.08,0; 4 7.62,0; 5 10.16,0; 6 12.7,0; 7 15.24,0; 8 17.78,0; 9 20.32,0; 10 22.86,0; 11 25.4,0
WR-MJ = drill 0.9 pad 1.4: 1 -11.43,10.92; 2 -10.16,13.46; 3 -8.89,10.92; 4 -7.62,13.46; 5 -6.35,10.92; 6 -5.08,13.46; 7 -3.81,10.92; 8 -2.54,13.46; 9 2.54,10.92; 10 3.81,13.46; 11 5.08,10.92; 12 6.35,13.46; 13 7.62,10.92; 14 8.89,13.46; 15 10.16,10.92; 16 11.43,13.46 | drill 1.6 pad 2.4: 17 0,14.81; 20 15.435,0; 21 -15.435,0 | hole 3.25: -12.7,4.57; 12.7,4.57
SML1206 = smd 1.5 x 1.5: A 1.75,0; C -1.75,0
QS = drill 0.61 long: 1 -2.54,0; 2 2.54,0
SOT669 = smd 0.7 x 1.4: 1 -1.905,-2.65; 2 -0.635,-2.65; 3 0.635,-2.65; 4 1.905,-2.65 | smd 5 x 4.3: MB 0,1
R0805 = smd 1.3 x 1.5: 1 -0.95,0; 2 0.95,0
R1210 = smd 1.6 x 2.7: 1 -1.4,0; 2 1.4,0
MA03-2 = drill 1.016: 1 -2.54,-1.27 | drill 1.016 octagon: 2 -2.54,1.27; 3 0,-1.27; 4 0,1.27; 5 2.54,-1.27; 6 2.54,1.27
SO08-MAX6675 = smd 0.6 x 2.2: 1 -1.905,-2.6; 2 -0.635,-2.6; 3 0.635,-2.6; 4 1.905,-2.6; 5 1.905,2.6; 6 0.635,2.6; 7 -0.635,2.6; 8 -1.905,2.6
22-23-2081 = drill 1 long: 1 -8.89,0; 2 -6.35,0; 3 -3.81,0; 4 -1.27,0; 5 1.27,0; 6 3.81,0; 7 6.35,0; 8 8.89,0
22-23-2101 = drill 1 long: 1 -11.43,0; 2 -8.89,0; 3 -6.35,0; 4 -3.81,0; 5 -1.27,0; 6 1.27,0; 7 3.81,0; 8 6.35,0; 9 8.89,0; 10 11.43,0
22-23-2041 = drill 1 long: 1 -3.81,0; 2 -1.27,0; 3 1.27,0; 4 3.81,0
22-23-2031 = drill 1 long: 1 -2.54,0; 2 0,0; 3 2.54,0

### Placement (x,y rotation side)
C1  25.4,63.5 270 top
C2  46.99,63.5 270 top
C3  32.26,58.42 90 top
C4  29.72,58.42 90 top
C5  30.48,64.77 90 top
C6  41.91,64.77 90 top
C7  29.72,47.5 180 top
C8  30.73,15.24 270 top
C9  38.86,15.24 270 top
C10  46.99,15.24 270 top
C11  55.12,15.24 270 top
C12  55.88,52.07 0 top
C13  48.77,34.8 0 top
C14  47.5,41.66 270 top
C16  84.58,29.46 180 top
C17  84.58,19.3 180 top
C18  68.33,7.62 90 top
D1  17.27,58.42 180 top
D2  11.43,55.37 0 top
D3  11.43,46.74 0 top
D4  11.43,38.1 0 top
D5  11.68,29.97 0 top
D6  11.94,20.07 0 top
H1  5.08,64.52 0 top
H2  5.08,5.08 0 top
H3  88.9,5.08 0 top
H4  88.65,64.26 0 top
IC1  36.32,62.23 180 top
IC2  55.88,48.26 270 top
IC3  38.1,38.1 270 top
IC4  70.1,24.13 180 top
J1  64.77,64.77 180 top
J2  14.73,64.77 0 top
J3  87.12,32.51 90 top
J4  4.32,52.83 90 top
J5  84.33,32.51 90 top
J6  89.92,32.51 90 top
J8  64.26,66.8 180 top
LED1  53.34,58.42 90 top
Q1  32.77,53.59 0 top
Q2  17.53,51.56 90 top
Q3  17.53,43.18 90 top
Q4  17.53,34.54 90 top
Q5  17.53,25.4 90 top
Q6  17.53,16.51 90 top
R1  31.5,49.53 0 top
R2  24.64,55.12 180 top
R3  25.4,52.07 270 top
R4  24.38,46.23 180 top
R5  25.15,43.18 270 top
R6  24.13,37.85 180 top
R7  25.15,34.54 270 top
R8  24.38,29.21 180 top
R9  25.4,26.16 270 top
R10  25.4,20.07 180 top
R11  25.91,17.02 270 top
R13  63.75,52.07 180 top
R14  70.61,15.24 270 top
R15  68.33,15.24 270 top
R16  66.04,15.24 270 top
R17  63.75,15.24 270 top
R18  53.34,64.77 270 top
SV1  43.18,53.85 180 top
U$1  34.8,17.78 0 top
U$2  42.93,17.78 0 top
U$3  51.05,17.78 0 top
U$4  59.18,17.78 0 top
X1  51.05,3.81 180 top
X2  23.37,3.81 180 top
X3  4.06,33.27 90 top
X6  74.68,3.81 180 top
X8  89.92,25.65 270 top
X9  89.92,14.99 270 top

### Tracks (layer width: path | path; a pad name or v marks a point on that pad's centre or on a via)
+5V  (via drill 0.35, 0.5)
  Top 0.305: IC3.52 47.68,34.56 C13.1 | 61.09,17.65 61.21,17.78 | IC3.63 IC3.64 | v49.78,58.67 49.6,58.49
  Top 0.406: IC3.64 IC3.62 | v43.69,50.04 43.81,50.16
  Top 0.508: IC3.52 44.95,34.56 v44.2,35.31 | v44.45,42.42 44.46,42.43 IC3.62 47.42,42.43 C14.1 | IC3.21 29.5,40.86 28.88,41.48 28.88,44.88 30.48,46.48 30.48,47.41 C7.1 30.57,49.51 R1.1 30.55,50.23 30.48,50.29 30.99,50.8 33.53,50.8 v34.29,50.04
  Top 0.61: 53.12,50.16 IC2.1 | U$4.4 61.09,17.65 | U$3.4 52.96,16.89 52.83,17.02 | C11.1 55.12,17.02 | C10.1 46.99,16.76 46.74,17.02 | U$2.4 44.83,17.02 | C9.1 38.86,17.02 | U$1.4 36.7,16.89 36.58,17.02 | IC4.9 65.66,22.35 | C17.1 88.14,19.3 X9.1 | C18.1 71.72,6.77 73.41,5.08 X6.3 | C16.1 88.65,29.46 X8.1
  Top 0.813: C8.1 31.66,17.02 36.58,17.02 38.86,17.02 44.83,17.02 46.74,17.02 52.83,17.02 55.12,17.02 60.45,17.02 61.21,17.78 64.49,21.06 IC4.9 | 65.66,22.35 66.42,23.11 76.45,23.11 v85.6,13.97 | IC2.1 43.81,50.16 v40.89,47.24 | LED1.C 55.03,54.98 C12.1 53.12,50.16
  Top 1.016: IC1.2 36.32,62.48 | 36.32,62.48 IC1.TAB 40.34,55.12 SV1.5 | 36.32,62.48 40.47,62.48 C6.1 44.17,63.92 C2.+ 49.6,58.49 | 49.6,58.49 51.42,56.67 LED1.C | v50.8,59.69 49.6,58.49
  Bottom 0.305: 87.12,13.97 87.63,13.46 87.63,11.18
  Bottom 0.61: 91.08,28.59 90.68,28.19 X8.1
  Bottom 0.813: v85.6,13.97 87.12,13.97 | v34.29,50.04 v43.69,50.04 | v44.2,35.31 44.45,35.56 v44.45,42.42 40.89,45.97 v40.89,47.24
  Bottom 1.016: 91.01,60.3 92.13,59.18 92.13,29.64 91.08,28.59 88.83,28.59 87.63,27.39 87.63,17.78 | 87.63,17.78 87.63,11.18 87.63,10.41 83.82,6.6 73.41,6.6 | 73.41,6.6 57.15,6.6 | 57.15,6.6 52.32,6.6 | 52.32,6.6 47.24,6.6 | 47.24,6.6 43.94,6.6 42.16,4.83 X1.8 | X1.6 47.24,6.6 | X1.4 52.32,6.6 | X1.2 57.4,6.35 57.15,6.6 | X6.3 73.41,6.6 | X9.1 87.88,17.53 87.63,17.78
  Bottom 1.27: v49.78,58.67 52.55,61.44 82.41,61.44 83.55,60.3 84.33,60.3 | 91.01,60.3 86.87,60.3 | 86.87,60.3 84.33,60.3 | J5.11 84.33,60.3 | J3.11 87.12,60.05 86.87,60.3
+12V  (via drill 0.35)
  Top 0.61: D2.C v11.18,55.37 | D3.C v11.18,46.74 | D4.C v11.18,38.1 | D5.C v11.43,29.97 | D6.C v11.68,20.07
  Top 1.778: J2.1 14.73,58.76 D1.A
  Bottom 0.813: v11.18,55.37 11.18,56.64 6.35,56.64 | v11.18,46.74 7.11,46.74 | v11.18,38.1 6.6,38.1 | v11.43,29.97 6.86,29.97 | v11.68,20.07 6.86,20.07
  pour Bottom (isolate 0.305, no thermals): 0.25,68.33 15.75,68.33 15.75,56.39 7.37,56.39 7.37,12.45 0.25,12.45
GND  (via drill 0.35)
  Top 0.305: v56.39,14.99 55.88,14.48 55.21,14.48 C11.2 | v48.26,14.99 48.01,14.73 47.33,14.73 C10.2 | v40.13,14.99 39.62,14.48 38.95,14.48 C9.2 | U$1.1 32.35,14.64 v32,14.99 | IC2.4 52.81,45.24 v52.83,45.21 | IC3.53 46.73,35.34 46.99,35.6 48.81,35.6 C13.2 | C4.2 30.99,59.27 | 30.99,59.27 C3.2 | 30.99,59.27 v30.99,60.71
  Top 0.406: IC3.22 29.27,40.07 28.19,41.15 28.19,46.82 C7.2 28.87,48.35 v28.7,48.51
  Top 0.508: C14.2 v47.5,39.62
  Top 0.61: C12.2 56.73,48.86 54.23,46.35 IC2.4 | C8.2 32.1,14.39 U$1.1 | C9.2 40.23,14.39 U$2.1 | C10.2 48.36,14.39 U$3.1 | C11.2 56.49,14.39 U$4.1 | X8.3 v86.11,23.11 | X9.3 v86.36,12.45 | C17.2 82.8,19.3 v82.3,19.81 | C18.2 69.38,9.36 v69.34,9.4 | Q2.1 21.14,49.66 | Q3.1 24.19,41.27 R5.2 | Q4.1 24.19,32.64 R7.2 | Q5.1 23.68,23.5 R9.2
  other vias: 82.3,28.7 20.57,48.51 21.59,49.53 21.59,50.55 20.57,40.13 21.59,41.15 22.61,41.15 20.57,31.5 21.59,31.5 22.61,32.51 20.57,22.35 21.59,22.35 23.62,22.35 23.37,14.48 21.34,15.49 22.35,14.48 55.12,66.55 55.12,65.02 55.12,63.5 50.55,35.05 65.53,24.89 67.06,24.89 47.5,37.59 21.59,48.51 22.61,40.13 21.59,32.51 21.59,23.37 21.34,14.48 22.61,22.35 22.61,31.5 21.59,40.13 21.59,51.56 22.35,15.49 68.58,24.89 70.1,24.89 71.63,24.89 73.15,24.89 22.61,48.51 22.61,49.53 22.61,50.55 23.62,48.51 22.61,51.56 23.62,49.53 23.62,50.55 23.62,51.56 23.62,52.58 22.61,52.58 21.59,52.58 23.62,40.13 23.62,41.15 23.62,42.16 23.62,43.18 23.62,44.2 21.59,42.16 22.61,42.16 22.61,43.18 21.59,43.18 21.59,44.2 22.61,44.2 21.59,33.53 21.59,34.54 21.59,35.56 23.62,31.5 23.62,32.51 23.62,33.53 22.61,33.53 22.61,34.54 23.62,34.54 23.62,35.56 22.61,35.56 22.61,23.37 23.62,23.37 23.62,24.38 22.61,24.38 21.59,24.38 21.59,25.4 21.59,26.42 22.61,26.42 22.61,25.4 23.62,25.4 23.62,26.42 24.38,14.48 23.37,15.49 24.38,15.49 21.34,16.51 21.34,17.53 22.35,17.53 22.35,16.51 23.37,17.53 23.37,16.51 24.38,16.51 24.38,17.53
  pour Bottom (isolate 0.305, no thermals): 26.92,68.33 93.47,68.33 93.47,0.25 0.25,0.25 0.25,11.68 26.92,11.68
  pour Top (isolate 0.406, no thermals): 93.47,0.25 93.47,69.34 0.25,69.34 0.25,49.02 1.52,49.02 8.89,56.39 19.56,56.39 19.56,12.45 26.16,12.45 26.16,62.74 54.36,62.74 54.36,61.72 27.18,61.72 27.18,19.3 27.31,12.57 26.42,11.68 0.25,11.68 0.25,0.25
  pour Bottom (isolate 0.305, no thermals): 26.16,68.33 26.16,12.45 19.56,12.45 19.56,56.39 16.51,56.39 16.51,68.33
N$2
  Top 0.61: Q2.4 21.83,55.12 R2.2
N$3
  Top 0.61: R14.2 70.61,13.46 60.96,3.81 X1.1
N$4
  Top 0.61: U$1.2 34.16,14.1 33.27,13.21 23.62,13.21 14.48,4.06 X2.8
N$5
  Top 0.61: X2.7 17.02,4.06 25.15,12.19 33.53,12.19 35.43,14.1 U$1.3
N$6
  Top 0.61: X2.6 19.56,4.57 26.16,11.18 39.37,11.18 42.29,14.1 U$2.2
N$7
  Top 0.61: X2.5 22.1,4.32 27.94,10.16 39.88,10.16 43.56,13.84 U$2.3
N$8
  Top 0.61: X2.4 24.64,4.57 29.21,9.14 40.19,9.14 44.23,13.18 49.69,13.18 50.42,13.9 U$3.2
N$9
  Top 0.61: X2.3 27.18,4.57 30.73,8.13 40.64,8.13 44.7,12.19 50.04,12.19 51.69,13.84 U$3.3
N$10
  Top 0.61: X2.2 29.72,4.83 32,7.11 41.15,7.11 45.21,11.18 55.63,11.18 58.55,14.1 U$4.2
N$11
  Top 0.61: X2.1 32.26,5.33 33.02,6.1 41.66,6.1 45.72,10.16 56.13,10.16 59.82,13.84 U$4.3
N$12
  Top 0.61: X1.3 54.86,4.57 56.13,5.84 60.45,5.84 68.33,13.72 R15.2
N$13
  Top 0.61: X1.5 49.78,4.57 51.82,6.6 59.18,6.6 66.04,13.46 R16.2
N$14
  Top 0.61: X1.7 44.7,4.75 47.32,7.37 57.91,7.37 63.75,13.21 R17.2
N$15
  Top 0.61: IC4.15 73.28,10.54 78.49,5.33 X6.1
N$18
  Top 0.406: C5.1 30.65,63.92
  Top 1.016: 32.6,63.92 IC1.3
  Top 1.524: D1.C 22.72,58.42 C1.+ 27.83,61.1 30.65,63.92 32.6,63.92
N$19
  Top 0.305: IC3.23 29.05,39.28 27.69,40.64 27.69,50.04 29.72,52.07 33.78,52.07 Q1.2 35.31,54.1 32.26,57.15 C3.1
N$20
  Top 0.305: IC3.24 30.29,38.44 28.98,38.44 27.23,40.2 27.23,50.6 Q1.1 30.23,57.06 C4.1
N$21
  Top 0.61: IC4.14 72.01,10.03 75.95,6.1 X6.2
N$22  (via drill 0.35)
  other vias: 18.54,53.59 18.54,52.58 18.54,51.56 18.54,50.55 18.54,49.53 18.54,48.51 14.48,48.51 13.46,48.51 16.51,50.55 16.51,51.56 16.51,52.58 16.51,53.59 15.49,48.51 17.53,51.56 17.53,52.58 17.53,53.59 17.53,50.55 17.53,49.53 17.53,48.51 16.51,48.51 16.51,49.53 14.48,54.61 13.46,54.61 13.46,53.59 13.46,52.58 13.46,51.56 13.46,50.55 13.46,49.53 14.48,53.59 14.48,52.58 14.48,51.56 14.48,50.55 14.48,49.53 15.49,49.53 15.49,50.55 15.49,51.56 15.49,52.58 15.49,53.59 15.49,54.61 16.51,54.61 17.53,54.61 18.54,54.61
  pour Top (isolate 0.305, no thermals): 0.76,41.91 0.76,47.24 9.14,55.63 18.8,55.63 18.8,47.75 9.14,47.75 7.87,46.48 7.87,44.45 5.33,41.91
  pour Bottom (isolate 0.305, no thermals): 18.8,55.63 18.8,47.75 8.13,47.75 8.13,55.63
N$23
  Top 0.61: Q3.4 21.32,46.23 R4.2
N$25  (via drill 0.35)
  other vias: 14.48,45.21 18.54,40.13 17.53,40.13 16.51,40.13 15.49,40.13 14.48,40.13 13.46,40.13 16.51,42.16 14.48,41.15 15.49,41.15 14.48,42.16 15.49,42.16 14.48,43.18 15.49,43.18 14.48,44.2 16.51,41.15 16.51,43.18 16.51,44.2 15.49,45.21 13.46,46.23 15.49,44.2 14.48,46.23 15.49,46.23 13.46,45.21 13.46,44.2 13.46,43.18 13.46,42.16 13.46,41.15 16.51,45.21 16.51,46.23 17.53,46.23 18.54,46.23 17.53,45.21 17.53,44.2 17.53,43.18 17.53,42.16 17.53,41.15 18.54,41.15 18.54,42.16 18.54,43.18 18.54,44.2 18.54,45.21
  pour Top (isolate 0.305, no thermals): 0.25,41.15 5.59,41.15 8.64,44.2 8.64,46.23 9.4,46.99 18.8,46.99 18.8,39.12 9.65,39.12 7.37,36.83 0.25,36.83
  pour Bottom (isolate 0.305, no thermals): 8.13,46.99 8.13,39.12 18.8,39.12 18.8,46.99
N$26
  Top 0.61: Q4.4 21.57,37.85 R6.2
N$27
  Top 0.61: J1.8 62.1,54.1 64.01,54.1 65.15,52.96 R13.1 65.15,51.43 65.28,51.31 62.87,48.9 IC2.7
N$28  (via drill 0.35)
  Top 0.305: Q4.MB 16.26,34.54
  other vias: 18.54,32.51 18.54,33.53 18.54,34.54 18.54,35.56 18.54,36.58 18.54,37.59 18.54,31.5 17.53,37.59 16.51,37.59 15.49,37.59 14.48,37.59 13.46,37.59 13.46,36.58 13.46,35.56 13.46,34.54 13.46,33.53 13.46,32.51 13.46,31.5 14.48,31.5 15.49,31.5 16.51,31.5 17.53,31.5 17.53,32.51 17.53,33.53 17.53,34.54 17.53,35.56 17.53,36.58 16.51,36.58 16.51,35.56 16.51,34.54 16.51,33.53 16.51,32.51 15.49,32.51 14.48,32.51 14.48,33.53 15.49,33.53 15.49,34.54 14.48,34.54 14.48,35.56 15.49,35.56 15.49,36.58 14.48,36.58
  pour Top (isolate 0.305, no thermals): 0.25,36.07 7.62,36.07 9.91,38.35 18.8,38.35 18.8,30.99 0.25,30.99
  pour Bottom (isolate 0.305, no thermals): 18.8,38.35 18.8,30.99 8.13,30.99 8.13,38.35
N$29
  Top 0.61: Q5.4 22.08,29.21 R8.2
N$30
  Top 0.61: R14.1 70.87,16.44 70.74,16.57 IC4.13
N$31  (via drill 0.35)
  other vias: 18.54,23.37 18.54,22.35 17.53,22.35 16.51,22.35 15.49,22.35 14.48,22.35 13.46,22.35 18.54,24.38 18.54,25.4 18.54,26.42 18.54,27.43 18.54,28.45 17.53,28.45 16.51,28.45 15.49,28.45 14.48,28.45 13.46,28.45 13.46,27.43 13.46,26.42 13.46,25.4 13.46,24.38 13.46,23.37 14.48,23.37 14.48,24.38 14.48,25.4 14.48,26.42 14.48,27.43 15.49,27.43 15.49,26.42 15.49,25.4 15.49,24.38 15.49,23.37 16.51,23.37 16.51,24.38 16.51,25.4 16.51,26.42 16.51,27.43 17.53,27.43 17.53,26.42 17.53,25.4 17.53,24.38 17.53,23.37
  pour Top (isolate 0.305, no thermals): 0.25,30.23 18.8,30.23 18.8,21.08 9.4,21.08 8.89,21.59 8.89,23.88 6.86,25.91 0.25,25.91
  pour Bottom (isolate 0.305, no thermals): 8.13,30.23 18.8,30.23 18.8,21.08 8.13,21.08
N$32
  Top 0.61: Q6.4 21.83,20.07 R10.2
N$33
  Top 0.61: IC2.5 64.64,46.35 71.12,52.83 71.12,59.44 70.36,60.2 65.91,60.2 J1.5
N$34  (via drill 0.35)
  Top 0.305: 17.03,16 17.27,16
  other vias: 18.54,14.48 18.54,13.46 17.53,13.46 16.51,13.46 15.49,13.46 14.48,13.46 13.46,13.46 13.46,14.48 13.46,15.49 13.46,16.51 13.46,17.53 13.46,18.54 13.46,19.56 14.48,19.56 15.49,19.56 16.51,19.56 17.53,19.56 18.54,19.56 18.54,18.54 18.54,17.53 18.54,16.51 18.54,15.49 17.53,14.48 17.53,15.49 17.53,16.51 17.53,17.53 17.53,18.54 16.51,18.54 16.51,17.53 16.51,16.51 16.51,15.49 16.51,14.48 15.49,14.48 15.49,15.49 15.49,16.51 15.49,17.53 15.49,18.54 14.48,14.48 14.48,15.49 14.48,16.51 14.48,17.53 14.48,18.54
  pour Top (isolate 0.305, no thermals): 0.25,25.15 6.6,25.15 8.13,23.62 8.13,21.34 9.14,20.32 18.8,20.32 18.8,12.45 0.25,12.45
  pour Bottom (isolate 0.305, no thermals): 8.13,20.32 18.8,20.32 18.8,12.45 8.13,12.45
N$36
  Top 0.61: J1.7 60.71,58.42 58.93,56.64 58.93,55.3 58.95,55.28 IC2.8 61.09,50.16 62.35,51.43 R13.2
N$38
  Top 0.61: R15.1 68.33,16.95 69.47,18.09 IC4.12
N$39
  Top 0.61: R16.1 66.04,16.44 68.2,18.6 IC4.11
N$40
  Top 0.61: R17.1 63.75,16.7 66.93,19.87 IC4.10
N$41
  Top 1.016: LED1.A R18.2
N$45
  Top 0.61: IC2.6 64.14,47.62 66.8,50.29 66.8,54.48 J1.4
PA0
  Top 0.305: IC4.4 70.74,27.81 68.33,30.23 51.56,30.23 48.02,33.77 IC3.51
PA1
  Top 0.305: IC4.5 69.47,28.07 67.82,29.72 51.31,29.72 48.04,32.98 IC3.50
PA2
  Top 0.305: IC4.6 68.2,28.57 67.56,29.21 51.05,29.21 48.07,32.19 IC3.49
PA3
  Top 0.305: IC4.7 66.93,28.07 66.29,28.7 46.77,28.7 45.13,30.34 IC3.48
PA4  (via drill 0.35)
  Top 0.305: v58.17,27.69 45.35,27.69 43.22,29.82 IC3.47
  Bottom 0.305: v58.17,27.69 62.38,23.47 73.41,23.47 76.61,26.67 76.61,30.18 79.5,33.08 79.5,39.65 81.43,41.58 81.43,49.16 83.84,51.56 88.65,51.56 J6.9
PA5  (via drill 0.35)
  Top 0.305: v57.4,26.92 45.33,26.92 42.43,29.82 IC3.46
  Bottom 0.305: v57.4,26.92 61.32,23.01 73.6,23.01 77.06,26.48 77.06,30 79.96,32.89 79.96,39.46 81.89,41.39 81.89,47.07 83.84,49.02 88.65,49.02 J6.8
PA6  (via drill 0.35)
  Top 0.305: v56.64,26.16 45.3,26.16 41.64,29.82 IC3.45
  Bottom 0.305: v56.64,26.16 60.25,22.55 73.79,22.55 77.52,26.29 77.52,29.81 80.42,32.7 80.42,39.27 82.35,41.2 82.35,44.99 83.84,46.48 88.65,46.48 J6.7
PA7  (via drill 0.35)
  Top 0.305: v55.88,25.4 45.28,25.4 40.86,29.82 IC3.44
  Bottom 0.305: v55.88,25.4 59.18,22.1 73.98,22.1 77.98,26.1 77.98,29.62 80.87,32.51 80.87,39.08 82.8,41.02 82.8,42.91 83.84,43.94 88.65,43.94 J6.6
PB0  (via drill 0.35)
  Top 0.305: IC3.10 36.92,44.03 v36.83,43.94 | J5.5 79.5,37.85 v72.39,37.85
  Bottom 0.305: v36.83,43.94 37.28,43.49 37.28,33.91 41.98,29.21 52.44,29.21 61.08,37.85 v72.39,37.85
PB1(SCK)
  Top 0.305: SV1.4 43.18,52.32 41.66,50.8 38.35,50.8 36.13,48.58 IC3.11
PB2(MOSI)
  Top 0.305: SV1.3 41.91,53.85 41.91,51.82 41.4,51.31 37.85,51.31 35.34,48.81 IC3.12
PB3(MISO)
  Top 0.305: SV1.6 38.1,52.58 34.56,49.03 IC3.13
PB4  (via drill 0.35)
  Top 0.305: IC3.14 33.77,45.01 35.85,42.93 v36.36,42.93 | J3.5 85.83,41.38 83.81,41.38 79.52,37.08 v73.66,37.08
  Bottom 0.305: v36.36,42.93 36.82,42.46 36.82,33.72 41.79,28.75 52.63,28.75 60.96,37.08 v73.66,37.08
PB5  (via drill 0.35)
  Top 0.305: IC3.15 32.98,44.89 v35.96,41.91 | v72.39,36.32 80.52,36.32 J5.4
  Bottom 0.305: v35.96,41.91 36.37,41.5 36.37,33.53 41.6,28.3 52.82,28.3 60.84,36.32 v72.39,36.32
PB6  (via drill 0.35)
  Top 0.305: IC3.16 32.19,44.77 35.31,41.66 35.31,41.15 v35.56,40.89 | J3.4 85.83,38.84 83.81,38.84 80.46,35.48 v73.66,35.48
  Bottom 0.305: v35.56,40.89 35.91,40.54 35.91,33.34 41.41,27.84 53.01,27.84 60.65,35.48 v73.66,35.48
PB7  (via drill 0.35)
  Top 0.305: IC3.17 32.19,44.01 34.67,41.53 34.67,40.26 v35.05,39.88 | J5.3 81.53,34.8 v72.39,34.8
  Bottom 0.305: v35.05,39.88 35.45,39.48 35.45,33.13 41.2,27.38 53.2,27.38 60.61,34.8 v72.39,34.8
PC0
  Top 0.305: IC3.35 33.77,27.67 35.43,26.01 U$1.6
PC1
  Top 0.305: U$2.6 43.56,21.65 43.05,22.16 40.33,22.16 34.54,27.94 34.54,30.33 IC3.36
PC2
  Top 0.305: IC3.37 35.34,27.9 40.39,22.86 50.23,22.86 51.69,21.4 U$3.6
PC3
  Top 0.305: IC3.38 36.13,27.88 40.64,23.37 58.17,23.37 59.82,21.72 U$4.6
PC4  (via drill 0.35)
  Top 0.305: IC3.39 36.92,28.87 v41.66,24.13
  Bottom 0.305: v41.66,24.13 45.97,19.81 74.93,19.81 80.26,25.15 80.26,28.19 83.06,30.99 88.39,30.99 J6.1
PC5  (via drill 0.35)
  Top 0.305: IC3.40 37.71,29.1 v42.67,24.13
  Bottom 0.305: v42.67,24.13 46.53,20.27 74.74,20.27 79.81,25.34 79.81,28.5 82.8,31.5 82.8,32.77 83.82,33.78 88.65,33.78 J6.2
PC6  (via drill 0.35)
  Top 0.305: IC3.41 38.49,29.32 v43.69,24.13
  Bottom 0.305: v43.69,24.13 47.09,20.73 74.55,20.73 79.35,25.52 79.35,28.8 82.3,31.75 82.3,34.78 83.84,36.32 88.65,36.32 J6.3
PC7  (via drill 0.35)
  Top 0.305: IC3.42 39.28,29.55 v44.7,24.13
  Bottom 0.305: v44.7,24.13 47.65,21.18 74.36,21.18 78.89,25.71 78.89,29.11 81.79,32 81.79,36.81 83.84,38.86 88.65,38.86 J6.4
PD0  (via drill 0.35)
  Top 0.305: IC3.25 32.91,37.71 33.53,37.08 v33.53,36.83 | J3.2 85.85,33.78 83.31,33.78 82.14,32.61 v73.66,32.61
  Bottom 0.305: v33.53,36.83 34.08,36.28 34.08,32.56 40.63,26.01 53.77,26.01 60.36,32.61 v73.66,32.61
PD1  (via drill 0.35)
  Top 0.305: v33.17,35.81 32.06,36.92 IC3.26 | J5.1 83.74,31.93 v72.39,31.93
  Bottom 0.305: v72.39,31.93 60.33,31.93 53.95,25.55 40.44,25.55 33.62,32.37 33.62,35.36 v33.17,35.81
PD2  (via drill 0.35)
  Top 0.305: v28.7,36.07 30.28,36.07 IC3.27 | v33.02,28.45 33.27,28.19 33.27,27.18 34.16,26.29 U$1.7
  Top 0.61: U$1.7 34.16,19.36 35.43,18.09 35.43,18.03 42.16,18.03 | 42.16,18.03 50.42,18.03 | 50.42,18.03 57.91,18.03 58.55,18.67 U$4.7 | U$3.7 50.42,18.03 | U$2.7 42.29,18.16 42.16,18.03
  Bottom 0.305: v33.02,28.45 29.72,31.75 29.72,34.29 28.7,35.31 v28.7,36.07
PD3  (via drill 0.35)
  Top 0.305: v32.77,34.8 32.22,35.34 IC3.28 | J3.1 85.85,31.24 v73.66,31.24
  Bottom 0.305: v32.77,34.8 33.17,34.4 33.17,32.18 40.25,25.09 54.14,25.09 60.29,31.24 v73.66,31.24
PD4
  Top 0.305: IC3.29 28.94,34.56 26.77,36.73 26.77,51.97 25.72,53.02 R3.1
  Top 0.61: R2.1 25.4,54.93 R3.1
PD5  (via drill 0.35)
  Top 0.305: v40.13,19.05 38.03,19.05 U$1.5 36.7,21.97 v36.58,22.1 | U$2.5 44.83,19.94 v45.72,19.05 v48.26,19.05 | U$3.5 52.96,19.94 v53.85,19.05 v56.39,19.05 | v60.2,18.54 61.09,19.43 U$4.5 | IC3.30 30.33,33.78 v28.96,33.78
  Bottom 0.305: v40.13,19.05 v45.72,19.05 | v48.26,19.05 v53.85,19.05 | v56.39,19.05 59.69,19.05 v60.2,18.54 | v36.58,22.1 28.96,29.72 v28.96,33.78
PD6
  Top 0.305: IC3.31 28.6,32.98 26.31,35.27 26.31,43.79 25.97,44.13 R5.1
  Top 0.61: R4.1 25.15,46.04 R5.1
PD7
  Top 0.305: IC3.32 30.14,32.4 28.54,32.4 25.44,35.49 R7.1
  Top 0.61: R7.1 25.08,35.56 R6.1
PE0  (via drill 0.35)
  Top 0.305: IC3.2 43.22,44.74 v39.12,40.65 | v73.66,40.05 78.42,40.05 83.08,44.71 83.08,45.73 83.81,46.46 85.83,46.46 J3.7
  Bottom 0.305: v39.12,40.65 39.12,40.6 38.94,40.41 38.94,34.19 42.55,30.58 51.87,30.58 61.34,40.05 v73.66,40.05
PE1
  Top 0.305: IC3.3 42.43,46.86 43.83,48.26 50.8,48.26 51.44,47.62 IC2.3
PE2
  Top 0.305: IC2.2 43.81,48.9 41.64,46.72 IC3.4
PE4  (via drill 0.35)
  Top 0.305: IC3.6 40.07,42.86 v38.61,41.4 | J5.6 78.49,39.37 v72.39,39.37
  Bottom 0.305: v38.61,41.4 38.35,41.15 38.35,34.13 42.36,30.12 52.06,30.12 61.31,39.37 v72.39,39.37
PE5  (via drill 0.35)
  Top 0.305: IC3.7 39.28,43.42 38.03,42.16 v37.99,42.16 | J3.6 85.83,43.92 83.81,43.92 78.5,38.61 v73.66,38.61
  Bottom 0.305: v37.99,42.16 37.74,41.91 37.74,34.1 42.17,29.67 52.25,29.67 61.19,38.61 v73.66,38.61
PE6  (via drill 0.35)
  Top 0.305: v46.48,45.97 49.53,42.93 49.53,38.49 52.73,35.29 52.73,32.87 53.85,31.75 70.36,31.75 73.15,28.96 74.93,28.96 81.53,22.35 81.53,19.56 86.11,14.99 X9.2 | v39.88,48.01 38.49,46.62 IC3.8
  Bottom 0.305: v46.48,45.97 44.45,48.01 v39.88,48.01
PE7  (via drill 0.35)
  Top 0.305: v46.74,46.99 50.04,43.69 50.04,38.63 53.19,35.48 53.19,33.06 54.04,32.21 70.66,32.21 73.46,29.41 75.12,29.41 78.88,25.65 X8.2 | v38.86,48.77 37.71,47.61 IC3.9
  Bottom 0.305: v46.74,46.99 44.96,48.77 v38.86,48.77
PF0  (via drill 0.35)
  Top 0.305: IC3.61 42.91,41.64 41.15,39.88 v39.62,39.88 | J5.7 82.55,45.97 82.55,44.96 78.49,40.89 v72.39,40.89
  Bottom 0.305: v39.62,39.88 39.5,39.75 39.5,34.28 42.74,31.04 51.68,31.04 61.54,40.89 v72.39,40.89
PF1  (via drill 0.35)
  Top 0.305: IC3.60 43.14,40.86 41.4,39.12 v41.15,39.12 | J3.8 85.83,49 83.81,49 82.07,47.25 82.07,45.24 78.49,41.66 v73.66,41.66
  Bottom 0.305: v41.15,39.12 40.39,39.12 39.96,38.69 39.96,34.47 42.93,31.5 51.49,31.5 61.65,41.66 v73.66,41.66
PF2  (via drill 0.35)
  Top 0.305: IC3.59 43.12,40.07 41.4,38.35 v40.64,38.35 | J5.8 81.61,47.57 81.61,45.47 78.56,42.42 v72.39,42.42
  Bottom 0.305: v40.64,38.35 40.47,38.18 40.47,34.61 43.12,31.95 51.3,31.95 61.77,42.42 v72.39,42.42
PF3  (via drill 0.35)
  Top 0.305: IC3.58 43.09,39.28 41.4,37.59 v41.15,37.59 | J3.9 85.83,51.54 83.81,51.54 81.03,48.75 81.03,45.53 78.68,43.18 v73.66,43.18
  Bottom 0.305: v41.15,37.59 41.15,37.34 40.97,37.16 40.97,34.75 43.31,32.41 51.11,32.41 61.88,43.18 v73.66,43.18
PF4  (via drill 0.35)
  Top 0.305: IC3.57 43.32,38.49 v41.66,36.83 | J5.9 80.57,49.07 80.57,45.72 78.79,43.94 v72.39,43.94
  Bottom 0.305: v41.66,36.83 41.66,36.58 41.48,36.4 41.48,34.88 43.5,32.87 50.92,32.87 62,43.94 v72.39,43.94
PF5  (via drill 0.35)
  Top 0.305: IC3.56 43.8,37.71 v42.16,36.07 | J3.10 85.85,54.1 83.31,54.1 80.11,50.9 80.11,45.97 78.84,44.7 v73.66,44.7
  Bottom 0.305: v42.16,36.07 41.99,35.89 41.99,35.02 43.69,33.33 50.73,33.33 62.12,44.7 v73.66,44.7
PF6  (via drill 0.35)
  Top 0.305: IC3.55 44.28,36.92 v42.67,35.31 | J5.10 83.52,54.56 83.12,54.56 79.65,51.09 79.65,46.48 78.64,45.47 v72.39,45.47
  Bottom 0.305: v42.67,35.31 44.2,33.78 50.55,33.78 62.18,45.41 72.34,45.41 v72.39,45.47
PF7
  Top 0.305: IC4.3 72.01,27.81 69.09,30.73 53.34,30.73 51.82,32.26 51.82,34.8 50.48,36.13 IC3.54
PG0
  Top 0.305: IC3.33 31.69,29.83 25.96,29.83 R8.1
  Top 0.61: R9.1 25.33,27.18 R8.1
PG1
  Top 0.305: IC3.34 32.98,29.68 32.51,29.21 27.69,29.21 26.67,28.19 26.67,20.39 R10.1
  Top 0.61: R10.1 26.35,18.41 R11.1
PG2  (via drill 0.35)
  Top 0.305: v55.12,24.64 45.25,24.64 40.07,29.82 IC3.43
  Bottom 0.305: v55.12,24.64 58.12,21.64 74.17,21.64 78.44,25.91 78.44,29.36 81.33,32.26 81.33,38.9 83.86,41.43 88.67,41.43 J6.5
PG3  (via drill 0.35)
  Top 0.305: v34.54,38.86 34.04,39.37 34.04,41.4 32.22,43.22 IC3.18 | J3.3 85.83,36.3 83.81,36.3 81.55,34.04 v73.66,34.04
  Bottom 0.305: v34.54,38.86 35,38.41 35,32.94 41.01,26.92 53.39,26.92 60.5,34.04 v73.66,34.04
PG4  (via drill 0.35)
  Top 0.305: v34.04,37.85 33.53,38.35 33.53,41.15 32.24,42.43 IC3.19 | J5.2 83.52,34.24 83.12,34.24 82.17,33.29 v72.39,33.29
  Bottom 0.305: v34.04,37.85 34.54,37.34 34.54,32.75 40.82,26.47 53.58,26.47 60.4,33.29 v72.39,33.29
PG5
  Top 0.305: IC4.2 73.28,27.81 69.85,31.24 53.54,31.24 52.27,32.51 52.27,35.1 49.02,38.35 49.02,42.67 46.48,45.21 44.65,45.21 IC3.1
RESET  (via drill 0.35)
  Top 0.305: SV1.2 44.96,52.58 42.42,50.04 38.86,50.04 v37.08,48.26 | 32.51,49.46 v32.51,47.5 29.44,44.42 29.44,41.94 29.73,41.64 IC3.20
  Top 0.406: 32.51,49.46 R1.2
  Bottom 0.305: v37.08,48.26 36.58,47.75 33.02,47.75 32.77,47.5 v32.51,47.5

### Text on the board
tNames: +12V | +5V | MOSI | GND | ISP | RS485 | +12V | SCK | MISO | RESET | F1 | 12V | v1 | F2 | Controller | 12V | F3 | Extruder | 12V | I/O | F4 | Hopper level | 12V | GND | F5 | 5V | 12V | Fans | Screw rotation | GND | Heaters | Motor | 5V | Thermocouples | T1+ | T1- | T2+ | T2- | T3+ | T3- | T4+ | T4- | 5V | SSR1 | 5V | SSR2 | 5V | SSR3 | 5V | SSR4 | GND | 5V | DIR | STEP